# EAGLE design max30205 (EAGLE 9.6.0)
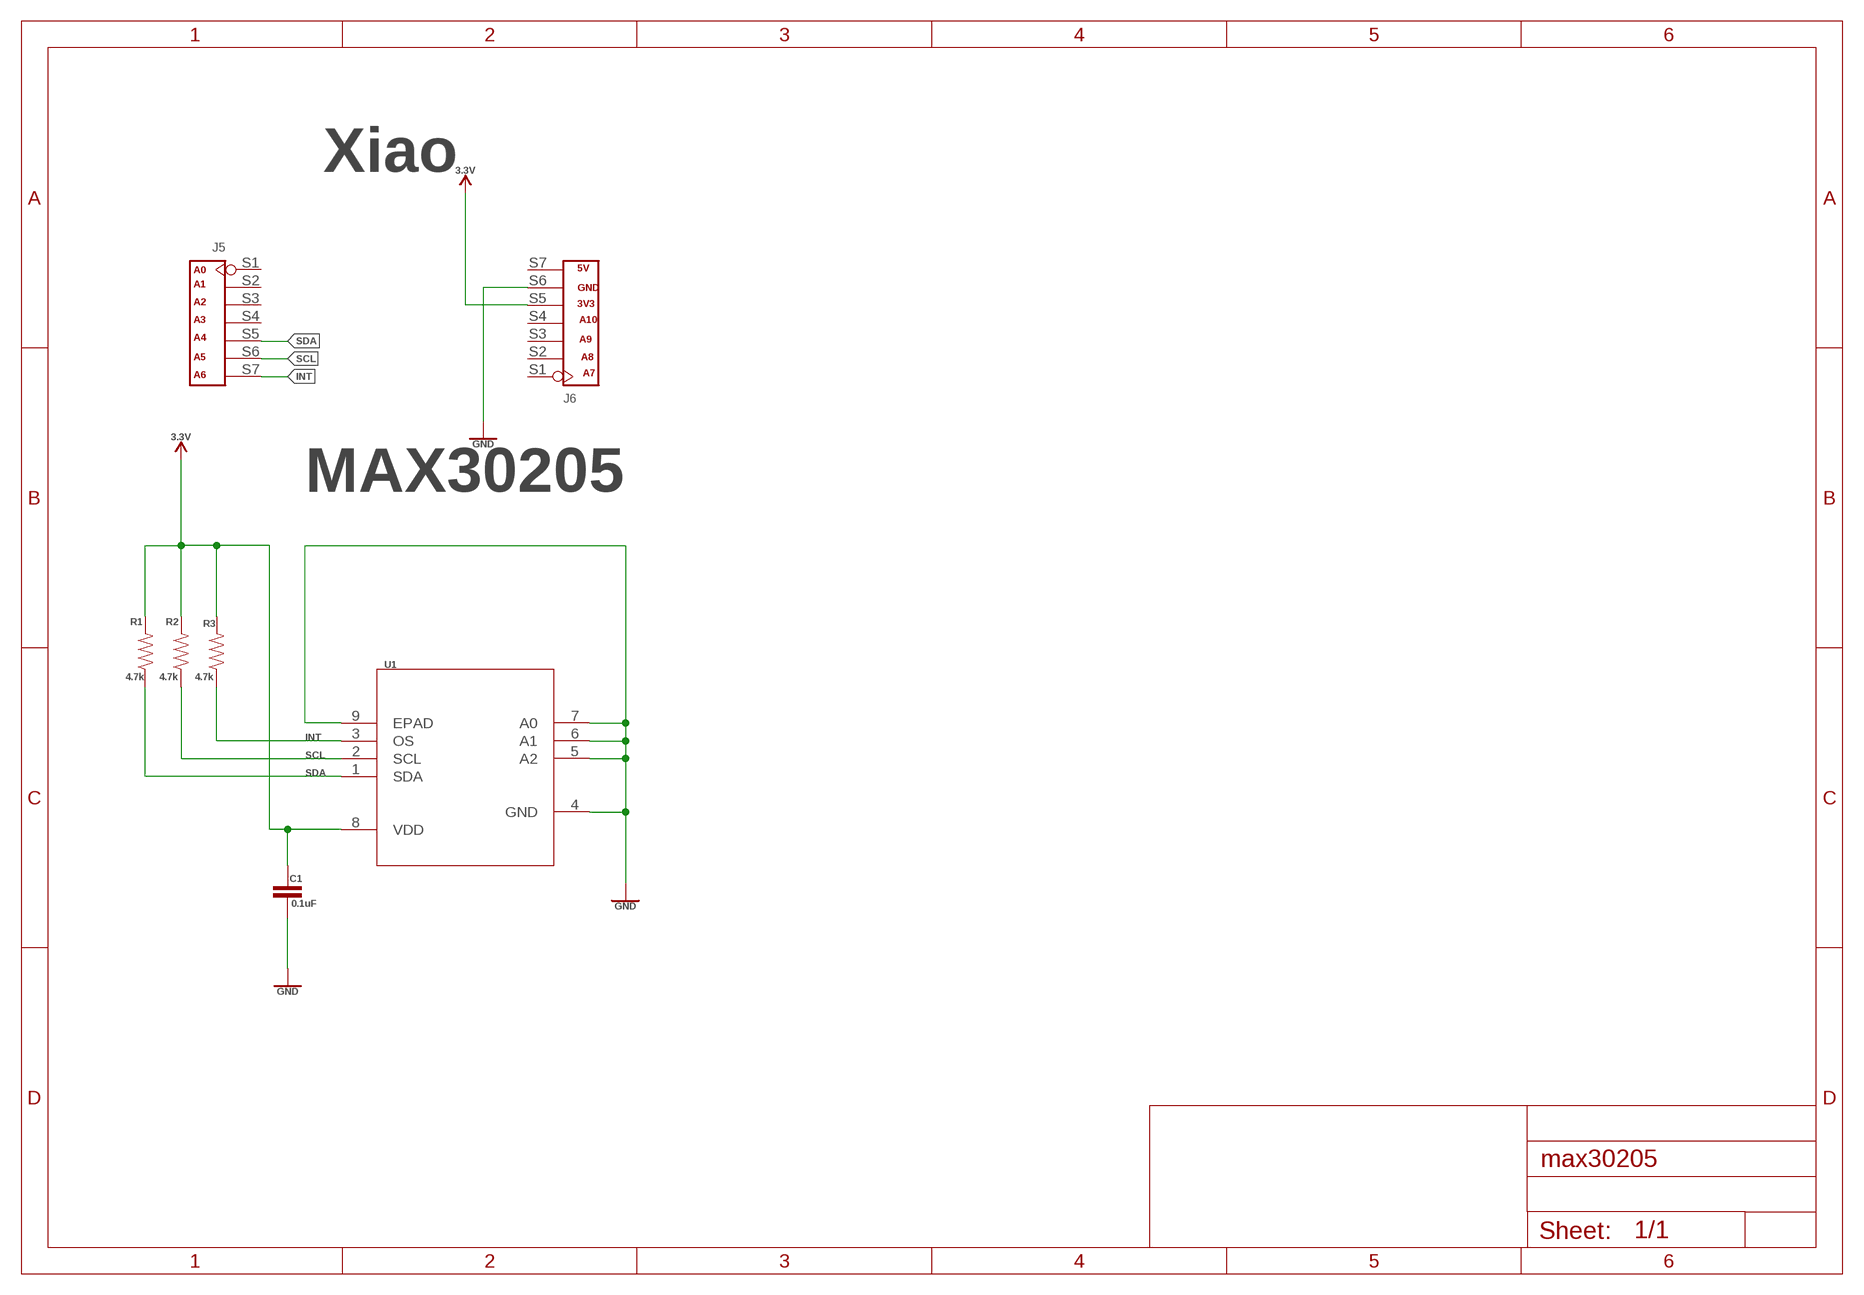
[diagram p0: schematic, sheet 1]

## Parts
C1  0.1uF  0.1UF-0603-25V-(+80/-20%)  [0603]
J5  DNP  CONNECTOR-NEW_HEADER-7P-HALF-HOLE  [CONNECTOR-V2]
J6  DNP  CONNECTOR-NEW_HEADER-7P-HALF-HOLE  [CONNECTOR-V2]
R1  4.7k  4.7KOHM-0603-1/10W-1%  [0603]
R2  4.7k  4.7KOHM-0603-1/10W-1%  [0603]
R3  4.7k  4.7KOHM-0603-1/10W-1%  [0603]
U1  MAX30205MTA+T21-0137I_T833-2_MXM-M  [21-0137I_T833-2_MXM-M]

## Nets
3.3V: C1.1 J6.S5 R1.2 R2.2 R3.2 U1.8(VDD)
GND: C1.2 J6.S6 U1.4(GND) U1.5(A2) U1.6(A1) U1.7(A0) U1.9(EPAD)
INT: J5.S7 R3.1 U1.3(OS)
SCL: J5.S6 R2.1 U1.2(SCL)
SDA: J5.S5 R1.1 U1.1(SDA)
Unconnected: J5.S1 J5.S2 J5.S3 J5.S4 J6.S1 J6.S2 J6.S3 J6.S4 J6.S7

## Notes on the sheet
- Xiao
- A0 | 5V
- A1
- GND
- A2 | 3V3
- A3 | A10
- A4 | A9
- A5 | A8
- A6 | A7
- MAX30205

## Library data of the parts
C1 = SparkFun-Capacitors:0.1UF: 0.1µF ceramic capacitors A capacitor is a passive two-terminal electrical component used to store electrical energy temporarily in an electric field.; PROD_ID: CAP-00810
J5 J6 = Seeeduino XIAO_v1.0_191112:CONNECTOR-NEW_HEADER-7P-HALF-HOLE
R1-R3 = SparkFun-Resistors:4.7KOHM: 4.7kΩ resistor A resistor is a passive two-terminal electrical component that implements electrical resistance as a circuit element. Resistors act to reduce current flow, and, at the same time, act to lower voltage levels within circuits. - Wikipedia; PROD_ID: RES-07857
U1 = MAX30205:MAX30205MTA+T; BUILT_BY: EMA_UL_Team; COPYRIGHT: Copyright (C) 2018 Accelerated Designs. All rights reserved; MANUFACTURER_PART_NUMBER: MAX30205MTA+T; SOURCELIBRARY: Maxim_2018-11-30; VENDOR: Maxim Integrated Products

## Board
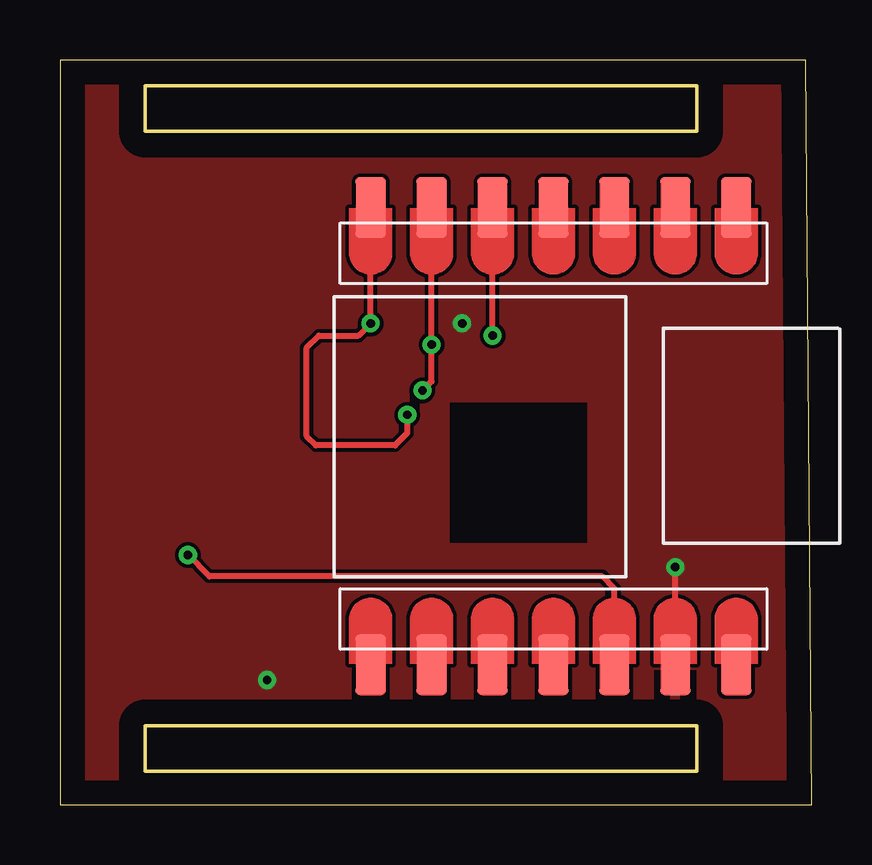
[diagram p1: board, top side]
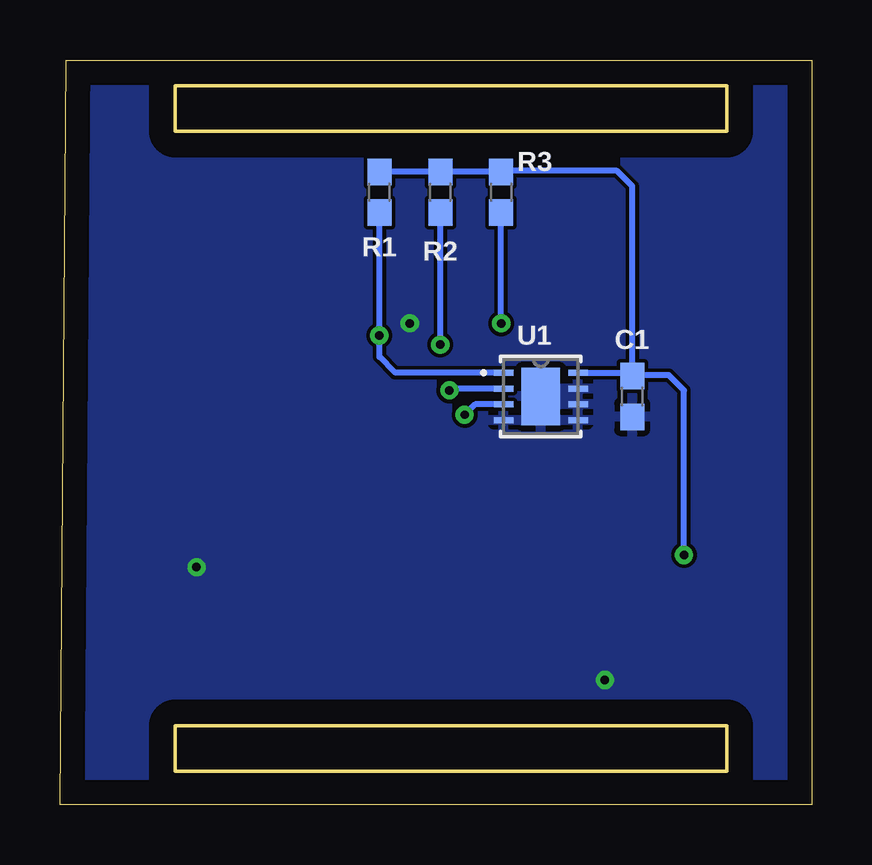
[diagram p2: board, bottom side, seen from below]

Size 31.35 x 31.04 mm. Coordinates in mm from the lower left corner, seen from the top.
Outline: 0,0 31.35,0 31.09,31.04 0,31.04 0,0
Outline: 3.56,29.97 26.54,29.97 26.54,28.07 3.56,28.07 3.56,29.97
Outline: 3.56,3.3 26.54,3.3 26.54,1.4 3.56,1.4 3.56,3.3
Copper layers (1*16): Top 0.035mm / dielectric 1.5mm / Bottom 0.035mm
Design rules "default": minimum track width 6mil, minimum drill 0.35mm, track to track 6mil, track to pad 6mil, pad to pad 6mil, via to via 6mil, smd to smd 6mil, copper to edge 40mil, drill to drill 6mil, minimum pad ring 10mil, minimum via ring 8mil, stop-mask expansion 4mil, vias tented up to drill 0mil, thermal gap 10mil
tRestrict: area 16.3,10.9 to 22,16.8

### Footprints (pad centres in the part's own frame; a part is rotated, then mirrored left to right if it is on the bottom)
0603 = smd 1.1 x 1: 1 -0.85,0; 2 0.85,0
CONNECTOR-V2 = smd 2.54 x 1.27: S1 -1.905,7.62; S2 -1.905,5.08; S3 -1.905,2.54; S4 -1.905,0; S5 -1.905,-2.54; S6 -1.905,-5.08; S7 -1.905,-7.62
21-0137I_T833-2_MXM-M = smd 0.806 x 0.254: 1 -1.553,0.991; 2 -1.553,0.33; 3 -1.553,-0.33; 4 -1.553,-0.991; 5 1.553,-0.991; 6 1.553,-0.33; 7 1.553,0.33; 8 1.553,0.991 | smd 1.6 x 2.388: 9 0,0

### Placement (x,y rotation side)
C1  7.49,17.02 270 bottom
J5  20.57,22.99 270 top
J6  20.57,7.75 90 top
R1  18.03,25.53 90 bottom
R2  15.49,25.53 90 bottom
R3  12.95,25.53 90 bottom
U1  11.3,17.02 0 bottom

### Tracks (layer width: path | path; a pad name or v marks a point on that pad's centre or on a via)
3.3V  (via drill 0.35)
  Top 0.254: J6.S5 23.11,9.02 22.61,9.53 6.22,9.53 v5.33,10.41
  Bottom 0.254: U1.8 7.63,18.01 C1.1 | C1.1 7.45,17.91 5.97,17.91 5.33,17.27 v5.33,10.41 | R1.2 R2.2 R3.2 12.92,26.42 8.13,26.42 7.49,25.78 C1.1
GND  (via drill 0.35)
  Top 0.254: J6.S6 v25.65,9.91
  other vias: 8.64,5.21 16.76,20.07
  pour Top: -9.14,-4.19 -9.14,31.11 31.24,31.11 31.24,-4.19
  pour Bottom: -9.08,-4.19 31.12,-4.19 31.12,30.99 -9.14,30.99 -9.14,-4.11
INT  (via drill 0.35)
  Top 0.254: v14.48,16.26 14.48,15.49 13.97,14.99 10.67,14.99 10.29,15.37 10.29,19.05 10.79,19.56 12.45,19.56 v12.95,20.07 J5.S7
  Bottom 0.254: U1.3 14.05,16.69 v14.48,16.26 | v12.95,20.07 R3.1
SCL  (via drill 0.35)
  Top 0.254: v15.11,17.27 15.49,17.65 v15.49,19.18 J5.S6
  Bottom 0.254: U1.2 15.04,17.35 v15.11,17.27 | v15.49,19.18 R2.1
SDA  (via drill 0.35)
  Top 0.254: v18.03,19.56 J5.S5
  Bottom 0.254: U1.1 17.37,18.01 18.03,18.67 v18.03,19.56 R1.1

### Text on the board
tTest: J4